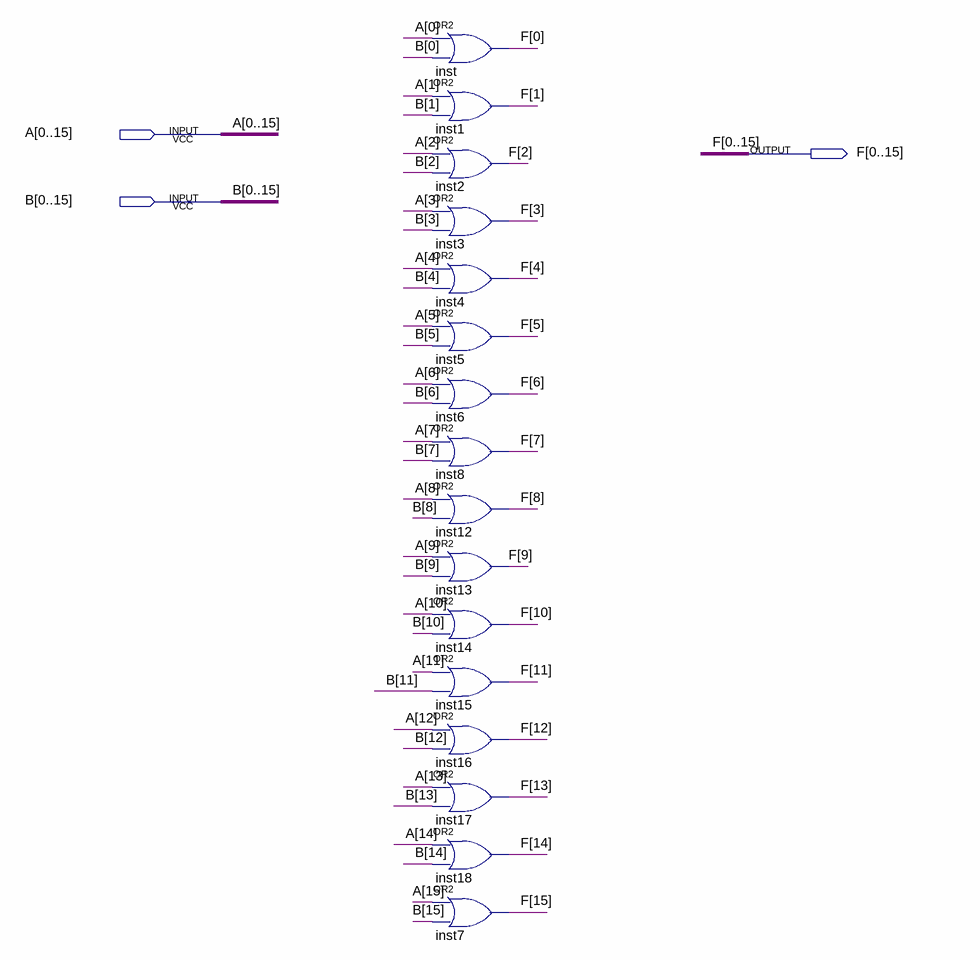
[diagram p0: schematic sheet]
// Quartus schematic 16bitor.bdf as structural Verilog: 16 symbols, 3 pins
module \16bitor  (
  input  [0:15] A,
  input  [0:15] B,
  output [0:15] F
);

  or inst (F[0], A[0], B[0]);
  or inst1 (F[1], A[1], B[1]);
  or inst2 (F[2], A[2], B[2]);
  or inst3 (F[3], A[3], B[3]);
  or inst4 (F[4], A[4], B[4]);
  or inst5 (F[5], A[5], B[5]);
  or inst6 (F[6], A[6], B[6]);
  or inst8 (F[7], A[7], B[7]);
  or inst12 (F[8], A[8], B[8]);
  or inst13 (F[9], A[9], B[9]);
  or inst14 (F[10], A[10], B[10]);
  or inst15 (F[11], A[11], B[11]);
  or inst16 (F[12], A[12], B[12]);
  or inst17 (F[13], A[13], B[13]);
  or inst18 (F[14], A[14], B[14]);
  or inst7 (F[15], A[15], B[15]);
endmodule
